# Altium schematic sheet VALVEBOARD_ValveDrive2.SchDoc
size A3; SheetNumber: 5; SheetTotal: 7
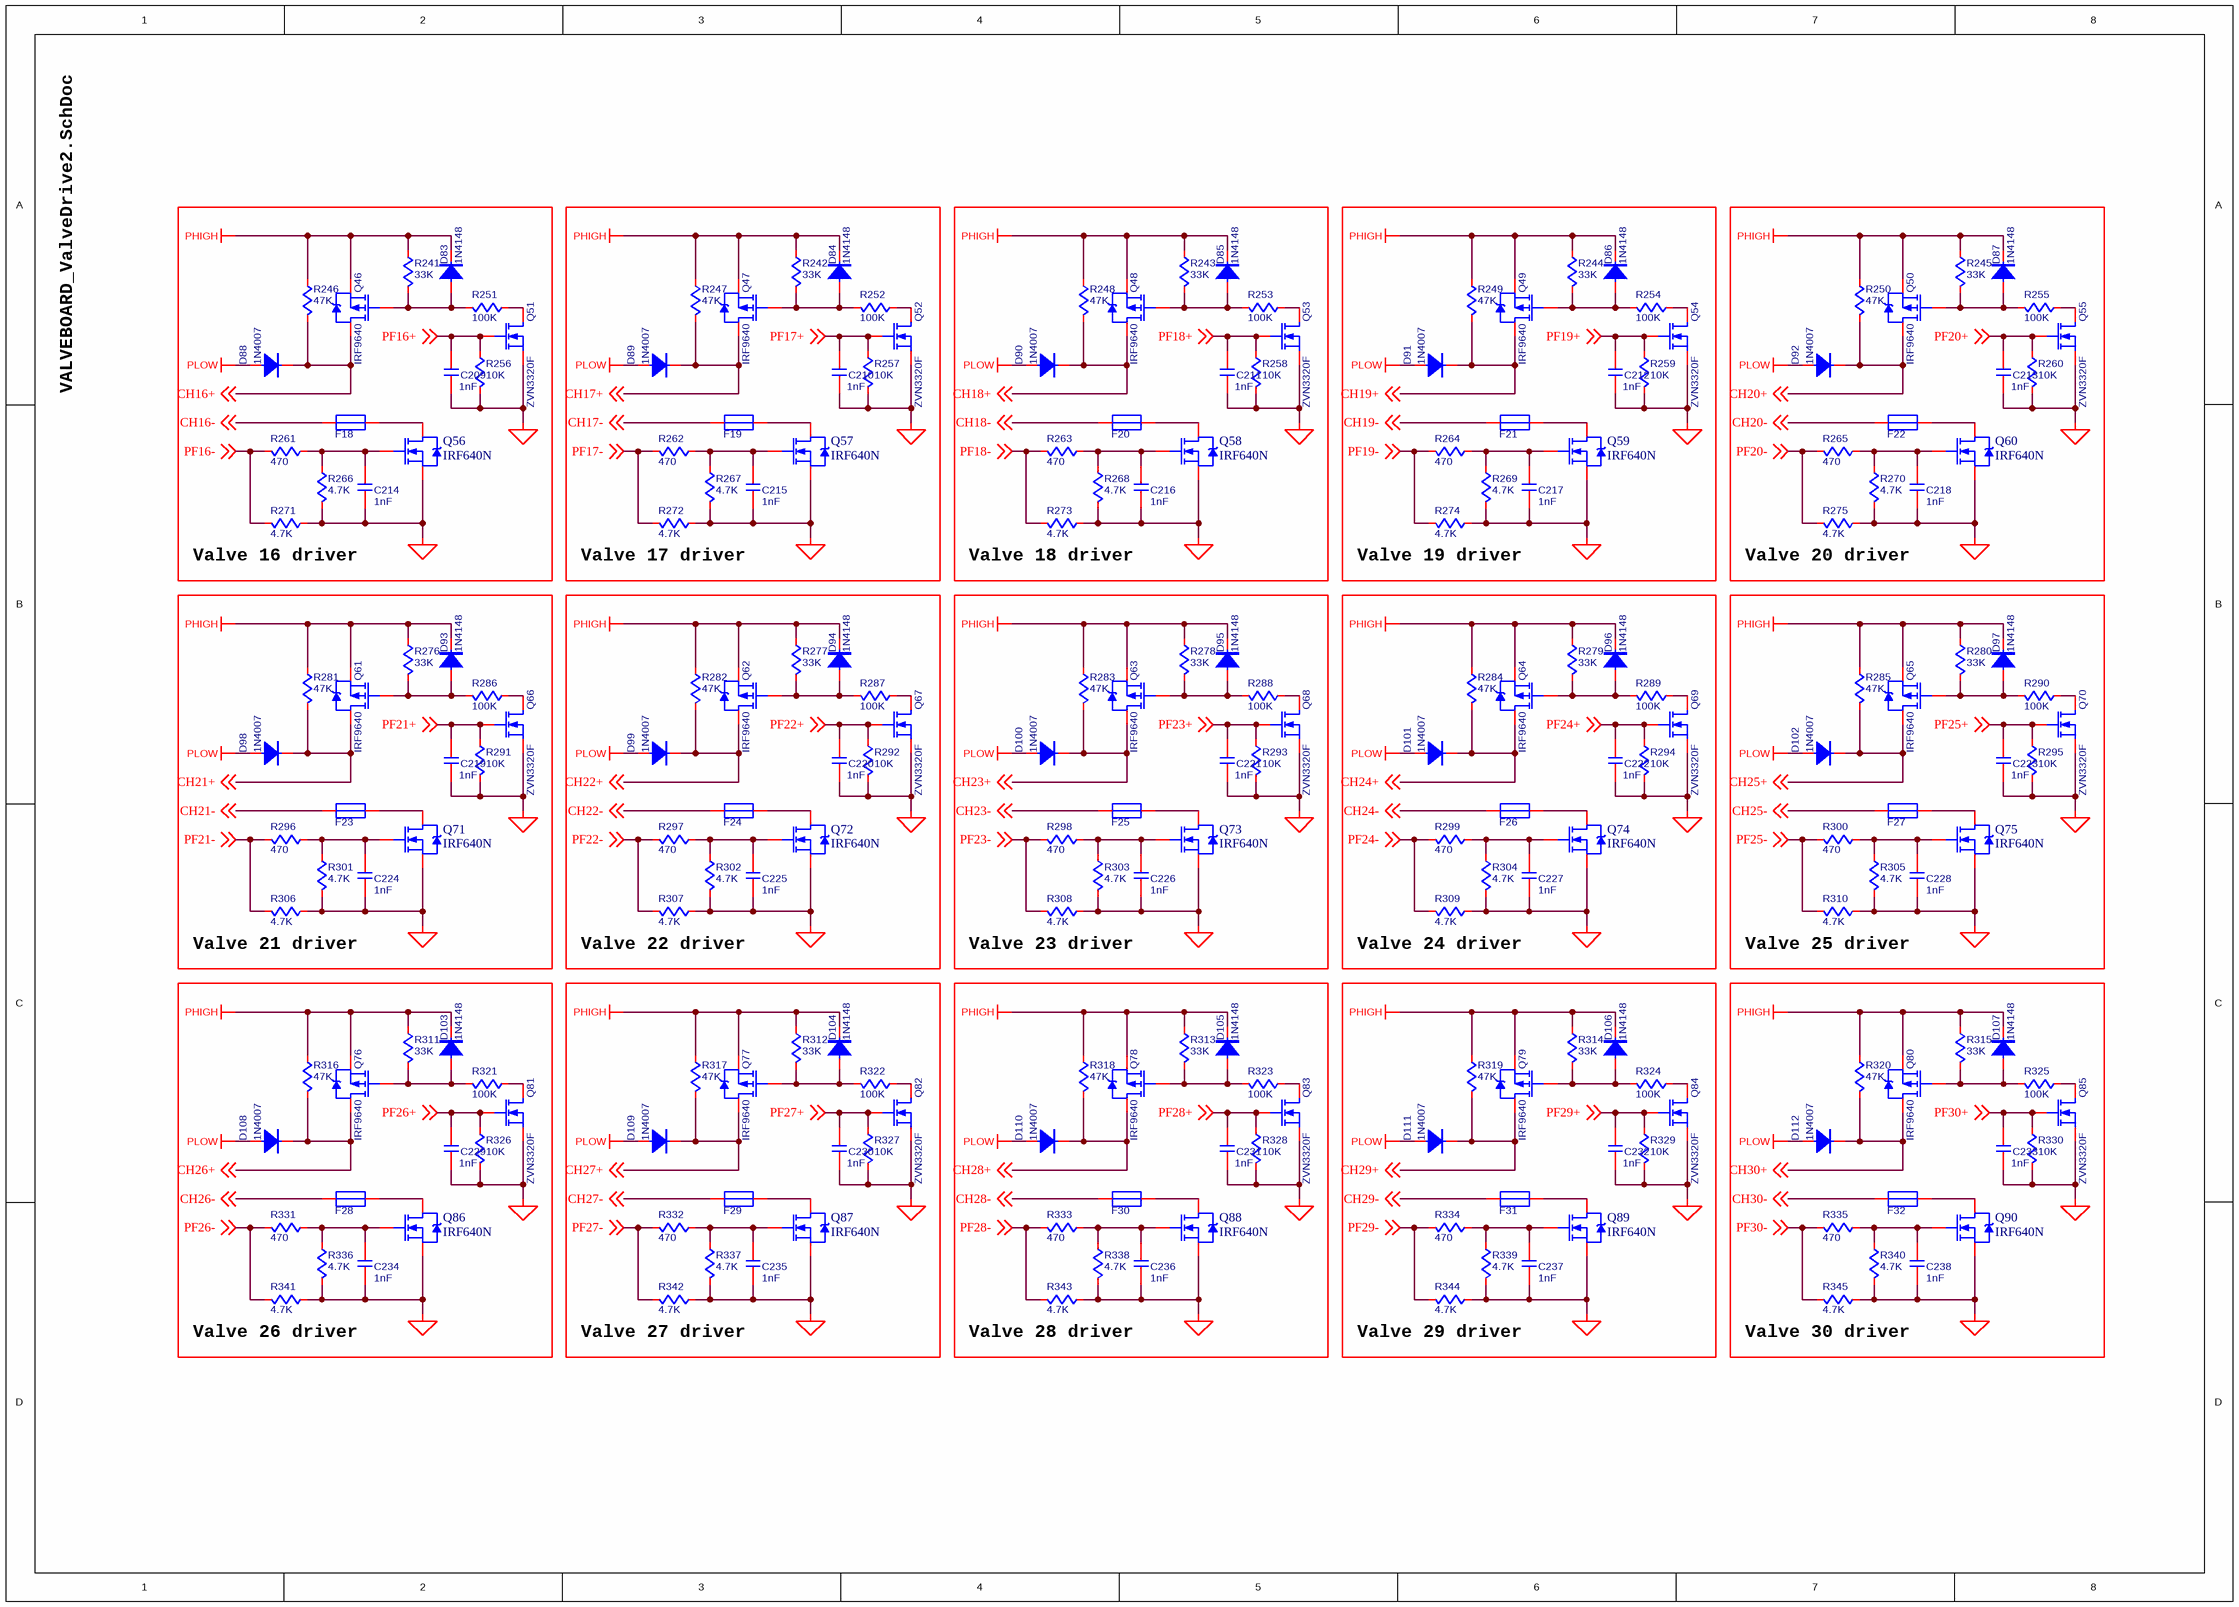
[diagram p0: VALVEBOARD_ValveDrive2.SchDoc]

## Parts
C209  value 1nF  [C0603]  (hidden comment: C-NOMO)
C210  value 1nF  [C0603]  (hidden comment: C-NOMO)
C211  value 1nF  [C0603]  (hidden comment: C-NOMO)
C212  value 1nF  [C0603]  (hidden comment: C-NOMO)
C213  value 1nF  [C0603]  (hidden comment: C-NOMO)
C214  value 1nF  [C0603]  (hidden comment: C-NOMO)
C215  value 1nF  [C0603]  (hidden comment: C-NOMO)
C216  value 1nF  [C0603]  (hidden comment: C-NOMO)
C217  value 1nF  [C0603]  (hidden comment: C-NOMO)
C218  value 1nF  [C0603]  (hidden comment: C-NOMO)
C219  value 1nF  [C0603]  (hidden comment: C-NOMO)
C220  value 1nF  [C0603]  (hidden comment: C-NOMO)
C221  value 1nF  [C0603]  (hidden comment: C-NOMO)
C222  value 1nF  [C0603]  (hidden comment: C-NOMO)
C223  value 1nF  [C0603]  (hidden comment: C-NOMO)
C224  value 1nF  [C0603]  (hidden comment: C-NOMO)
C225  value 1nF  [C0603]  (hidden comment: C-NOMO)
C226  value 1nF  [C0603]  (hidden comment: C-NOMO)
C227  value 1nF  [C0603]  (hidden comment: C-NOMO)
C228  value 1nF  [C0603]  (hidden comment: C-NOMO)
C229  value 1nF  [C0603]  (hidden comment: C-NOMO)
C230  value 1nF  [C0603]  (hidden comment: C-NOMO)
C231  value 1nF  [C0603]  (hidden comment: C-NOMO)
C232  value 1nF  [C0603]  (hidden comment: C-NOMO)
C233  value 1nF  [C0603]  (hidden comment: C-NOMO)
C234  value 1nF  [C0603]  (hidden comment: C-NOMO)
C235  value 1nF  [C0603]  (hidden comment: C-NOMO)
C236  value 1nF  [C0603]  (hidden comment: C-NOMO)
C237  value 1nF  [C0603]  (hidden comment: C-NOMO)
C238  value 1nF  [C0603]  (hidden comment: C-NOMO)
D83  1N4148  [sod-123]
D84  1N4148  [sod-123]
D85  1N4148  [sod-123]
D86  1N4148  [sod-123]
D87  1N4148  [sod-123]
D88  1N4007  [1N4148]
D89  1N4007  [1N4148]
D90  1N4007  [1N4148]
D91  1N4007  [1N4148]
D92  1N4007  [1N4148]
D93  1N4148  [sod-123]
D94  1N4148  [sod-123]
D95  1N4148  [sod-123]
D96  1N4148  [sod-123]
D97  1N4148  [sod-123]
D98  1N4007  [1N4148]
D99  1N4007  [1N4148]
D100  1N4007  [1N4148]
D101  1N4007  [1N4148]
D102  1N4007  [1N4148]
D103  1N4148  [sod-123]
D104  1N4148  [sod-123]
D105  1N4148  [sod-123]
D106  1N4148  [sod-123]
D107  1N4148  [SOD-123]
D108  1N4007  [1N4148]
D109  1N4007  [1N4148]
D110  1N4007  [1N4148]
D111  1N4007  [1N4148]
D112  1N4007  [1N4148]
F18  F50  [F-TH]  (value not drawn)
F19  F50  [F-TH]  (value not drawn)
F20  F50  [F-TH]  (value not drawn)
F21  F50  [F-TH]  (value not drawn)
F22  F50  [F-TH]  (value not drawn)
F23  F50  [F-TH]  (value not drawn)
F24  F50  [F-TH]  (value not drawn)
F25  F50  [F-TH]  (value not drawn)
F26  F50  [F-TH]  (value not drawn)
F27  F50  [F-TH]  (value not drawn)
F28  F50  [F-TH]  (value not drawn)
F29  F50  [F-TH]  (value not drawn)
F30  F50  [F-TH]  (value not drawn)
F31  F50  [F-TH]  (value not drawn)
F32  F50  [F-TH]  (value not drawn)
Q46  IRF9640  [TO-220AB]
Q47  IRF9640  [TO-220AB]
Q48  IRF9640  [TO-220AB]
Q49  IRF9640  [TO-220AB]
Q50  IRF9640  [TO-220AB]
Q51  ZVN3320F  [ZVN3320F]
Q52  ZVN3320F  [ZVN3320F]
Q53  ZVN3320F  [ZVN3320F]
Q54  ZVN3320F  [ZVN3320F]
Q55  ZVN3320F  [ZVN3320F]
Q56  IRF640N  [TO-220AB]
Q57  IRF640N  [TO-220AB]
Q58  IRF640N  [TO-220AB]
Q59  IRF640N  [TO-220AB]
Q60  IRF640N  [TO-220AB]
Q61  IRF9640  [TO-220AB]
Q62  IRF9640  [TO-220AB]
Q63  IRF9640  [TO-220AB]
Q64  IRF9640  [TO-220AB]
Q65  IRF9640  [TO-220AB]
Q66  ZVN3320F  [ZVN3320F]
Q67  ZVN3320F  [ZVN3320F]
Q68  ZVN3320F  [ZVN3320F]
Q69  ZVN3320F  [ZVN3320F]
Q70  ZVN3320F  [ZVN3320F]
Q71  IRF640N  [TO-220AB]
Q72  IRF640N  [TO-220AB]
Q73  IRF640N  [TO-220AB]
Q74  IRF640N  [TO-220AB]
Q75  IRF640N  [TO-220AB]
Q76  IRF9640  [TO-220AB]
Q77  IRF9640  [TO-220AB]
Q78  IRF9640  [TO-220AB]
Q79  IRF9640  [TO-220AB]
Q80  IRF9640  [TO-220AB]
Q81  ZVN3320F  [ZVN3320F]
Q82  ZVN3320F  [ZVN3320F]
Q83  ZVN3320F  [ZVN3320F]
Q84  ZVN3320F  [ZVN3320F]
Q85  ZVN3320F  [ZVN3320F]
Q86  IRF640N  [TO-220AB]
Q87  IRF640N  [TO-220AB]
Q88  IRF640N  [TO-220AB]
Q89  IRF640N  [TO-220AB]
Q90  IRF640N  [TO-220AB]
R241  value 33K  [R0603]  (hidden comment: R)
R242  value 33K  [R0603]  (hidden comment: R)
R243  value 33K  [R0603]  (hidden comment: R)
R244  value 33K  [R0603]  (hidden comment: R)
R245  value 33K  [R0603]  (hidden comment: R)
R246  value 47K  [R2512]  (hidden comment: R)
R247  value 47K  [R2512]  (hidden comment: R)
R248  value 47K  [R2512]  (hidden comment: R)
R249  value 47K  [R2512]  (hidden comment: R)
R250  value 47K  [R2512]  (hidden comment: R)
R251  value 100K  [R0603]  (hidden comment: R)
R252  value 100K  [R0603]  (hidden comment: R)
R253  value 100K  [R0603]  (hidden comment: R)
R254  value 100K  [R0603]  (hidden comment: R)
R255  value 100K  [R0603]  (hidden comment: R)
R256  value 10K  [R0603]  (hidden comment: R)
R257  value 10K  [R0603]  (hidden comment: R)
R258  value 10K  [R0603]  (hidden comment: R)
R259  value 10K  [R0603]  (hidden comment: R)
R260  value 10K  [R0603]  (hidden comment: R)
R261  value 470  [R0402]  (hidden comment: R)
R262  value 470  [R0402]  (hidden comment: R)
R263  value 470  [R0402]  (hidden comment: R)
R264  value 470  [R0402]  (hidden comment: R)
R265  value 470  [R0402]  (hidden comment: R)
R266  value 4.7K  [R0402]  (hidden comment: R)
R267  value 4.7K  [R0402]  (hidden comment: R)
R268  value 4.7K  [R0402]  (hidden comment: R)
R269  value 4.7K  [R0402]  (hidden comment: R)
R270  value 4.7K  [R0402]  (hidden comment: R)
R271  value 4.7K  [R0402]  (hidden comment: R)
R272  value 4.7K  [R0402]  (hidden comment: R)
R273  value 4.7K  [R0402]  (hidden comment: R)
R274  value 4.7K  [R0402]  (hidden comment: R)
R275  value 4.7K  [R0402]  (hidden comment: R)
R276  value 33K  [R0603]  (hidden comment: R)
R277  value 33K  [R0603]  (hidden comment: R)
R278  value 33K  [R0603]  (hidden comment: R)
R279  value 33K  [R0603]  (hidden comment: R)
R280  value 33K  [R0603]  (hidden comment: R)
R281  value 47K  [R2512]  (hidden comment: R)
R282  value 47K  [R2512]  (hidden comment: R)
R283  value 47K  [R2512]  (hidden comment: R)
R284  value 47K  [R2512]  (hidden comment: R)
R285  value 47K  [R2512]  (hidden comment: R)
R286  value 100K  [R0603]  (hidden comment: R)
R287  value 100K  [R0603]  (hidden comment: R)
R288  value 100K  [R0603]  (hidden comment: R)
R289  value 100K  [R0603]  (hidden comment: R)
R290  value 100K  [R0603]  (hidden comment: R)
R291  value 10K  [R0603]  (hidden comment: R)
R292  value 10K  [R0603]  (hidden comment: R)
R293  value 10K  [R0603]  (hidden comment: R)
R294  value 10K  [R0603]  (hidden comment: R)
R295  value 10K  [R0603]  (hidden comment: R)
R296  value 470  [R0402]  (hidden comment: R)
R297  value 470  [R0402]  (hidden comment: R)
R298  value 470  [R0402]  (hidden comment: R)
R299  value 470  [R0402]  (hidden comment: R)
R300  value 470  [R0402]  (hidden comment: R)
R301  value 4.7K  [R0402]  (hidden comment: R)
R302  value 4.7K  [R0402]  (hidden comment: R)
R303  value 4.7K  [R0402]  (hidden comment: R)
R304  value 4.7K  [R0402]  (hidden comment: R)
R305  value 4.7K  [R0402]  (hidden comment: R)
R306  value 4.7K  [R0402]  (hidden comment: R)
R307  value 4.7K  [R0402]  (hidden comment: R)
R308  value 4.7K  [R0402]  (hidden comment: R)
R309  value 4.7K  [R0402]  (hidden comment: R)
R310  value 4.7K  [R0402]  (hidden comment: R)
R311  value 33K  [R0603]  (hidden comment: R)
R312  value 33K  [R0603]  (hidden comment: R)
R313  value 33K  [R0603]  (hidden comment: R)
R314  value 33K  [R0603]  (hidden comment: R)
R315  value 33K  [R0603]  (hidden comment: R)
R316  value 47K  [R2512]  (hidden comment: R)
R317  value 47K  [R2512]  (hidden comment: R)
R318  value 47K  [R2512]  (hidden comment: R)
R319  value 47K  [R2512]  (hidden comment: R)
R320  value 47K  [R2512]  (hidden comment: R)
R321  value 100K  [R0603]  (hidden comment: R)
R322  value 100K  [R0603]  (hidden comment: R)
R323  value 100K  [R0603]  (hidden comment: R)
R324  value 100K  [R0603]  (hidden comment: R)
R325  value 100K  [R0603]  (hidden comment: R)
R326  value 10K  [R0603]  (hidden comment: R)
R327  value 10K  [R0603]  (hidden comment: R)
R328  value 10K  [R0603]  (hidden comment: R)
R329  value 10K  [R0603]  (hidden comment: R)
R330  value 10K  [R0603]  (hidden comment: R)
R331  value 470  [R0402]  (hidden comment: R)
R332  value 470  [R0402]  (hidden comment: R)
R333  value 470  [R0402]  (hidden comment: R)
R334  value 470  [R0402]  (hidden comment: R)
R335  value 470  [R0402]  (hidden comment: R)
R336  value 4.7K  [R0402]  (hidden comment: R)
R337  value 4.7K  [R0402]  (hidden comment: R)
R338  value 4.7K  [R0402]  (hidden comment: R)
R339  value 4.7K  [R0402]  (hidden comment: R)
R340  value 4.7K  [R0402]  (hidden comment: R)
R341  value 4.7K  [R0402]  (hidden comment: R)
R342  value 4.7K  [R0402]  (hidden comment: R)
R343  value 4.7K  [R0402]  (hidden comment: R)
R344  value 4.7K  [R0402]  (hidden comment: R)
R345  value 4.7K  [R0402]  (hidden comment: R)

## Blocks framed on the sheet
Valve 16 driver: C209 C214 D83 D88 F18 Q46 Q51 Q56 R241 R246 R251 R256 R261 R266 R271
Valve 17 driver: C210 C215 D84 D89 F19 Q47 Q52 Q57 R242 R247 R252 R257 R262 R267 R272
Valve 18 driver: C211 C216 D85 D90 F20 Q48 Q53 Q58 R243 R248 R253 R258 R263 R268 R273
Valve 19 driver: C212 C217 D86 D91 F21 Q49 Q54 Q59 R244 R249 R254 R259 R264 R269 R274
Valve 20 driver: C213 C218 D87 D92 F22 Q50 Q55 Q60 R245 R250 R255 R260 R265 R270 R275
Valve 21 driver: C219 C224 D93 D98 F23 Q61 Q66 Q71 R276 R281 R286 R291 R296 R301 R306
Valve 22 driver: C220 C225 D94 D99 F24 Q62 Q67 Q72 R277 R282 R287 R292 R297 R302 R307
Valve 23 driver: C221 C226 D95 D100 F25 Q63 Q68 Q73 R278 R283 R288 R293 R298 R303 R308
Valve 24 driver: C222 C227 D96 D101 F26 Q64 Q69 Q74 R279 R284 R289 R294 R299 R304 R309
Valve 25 driver: C223 C228 D97 D102 F27 Q65 Q70 Q75 R280 R285 R290 R295 R300 R305 R310
Valve 26 driver: C229 C234 D103 D108 F28 Q76 Q81 Q86 R311 R316 R321 R326 R331 R336 R341
Valve 27 driver: C230 C235 D104 D109 F29 Q77 Q82 Q87 R312 R317 R322 R327 R332 R337 R342
Valve 28 driver: C231 C236 D105 D110 F30 Q78 Q83 Q88 R313 R318 R323 R328 R333 R338 R343
Valve 29 driver: C232 C237 D106 D111 F31 Q79 Q84 Q89 R314 R319 R324 R329 R334 R339 R344
Valve 30 driver: C233 C238 D107 D112 F32 Q80 Q85 Q90 R315 R320 R325 R330 R335 R340 R345

## Nets
PGND: C209.1 C210.1 C211.1 C212.1 C213.1 C214.1 C215.1 C216.1 C217.1 C218.1 C219.1 C220.1 C221.1 C222.1 C223.1 C224.1 C225.1 C226.1 C227.1 C228.1 C229.1 C230.1 C231.1 C232.1 C233.1 C234.1 C235.1 C236.1 C237.1 C238.1 Q51.3(S) Q52.3(S) Q53.3(S) Q54.3(S) Q55.3(S) Q56.3(S) Q57.3(S) Q58.3(S) Q59.3(S) Q60.3(S) Q66.3(S) Q67.3(S) Q68.3(S) Q69.3(S) Q70.3(S) Q71.3(S) Q72.3(S) Q73.3(S) Q74.3(S) Q75.3(S) Q81.3(S) Q82.3(S) Q83.3(S) Q84.3(S) Q85.3(S) Q86.3(S) Q87.3(S) Q88.3(S) Q89.3(S) Q90.3(S) R256.1 R257.1 R258.1 R259.1 R260.1 R266.1 R267.1 R268.1 R269.1 R270.1 R271.2 R272.2 R273.2 R274.2 R275.2 R291.1 R292.1 R293.1 R294.1 R295.1 R301.1 R302.1 R303.1 R304.1 R305.1 R306.2 R307.2 R308.2 R309.2 R310.2 R326.1 R327.1 R328.1 R329.1 R330.1 R336.1 R337.1 R338.1 R339.1 R340.1 R341.2 R342.2 R343.2 R344.2 R345.2
PHIGH: D83.1 D84.1 D85.1 D86.1 D87.1 D93.1 D94.1 D95.1 D96.1 D97.1 D103.1 D104.1 D105.1 D106.1 D107.1 Q46.3(S) Q47.3(S) Q48.3(S) Q49.3(S) Q50.3(S) Q61.3(S) Q62.3(S) Q63.3(S) Q64.3(S) Q65.3(S) Q76.3(S) Q77.3(S) Q78.3(S) Q79.3(S) Q80.3(S) R241.2 R242.2 R243.2 R244.2 R245.2 R246.2 R247.2 R248.2 R249.2 R250.2 R276.2 R277.2 R278.2 R279.2 R280.2 R281.2 R282.2 R283.2 R284.2 R285.2 R311.2 R312.2 R313.2 R314.2 R315.2 R316.2 R317.2 R318.2 R319.2 R320.2
PLOW: D88.2 D89.2 D90.2 D91.2 D92.2 D98.2 D99.2 D100.2 D101.2 D102.2 D108.2 D109.2 D110.2 D111.2 D112.2
CH16+: D88.1 Q46.2(D) R246.1 ; off-sheet CH16+
CH16-: F18.1 ; off-sheet CH16-
CH17+: D89.1 Q47.2(D) R247.1 ; off-sheet CH17+
CH17-: F19.1 ; off-sheet CH17-
CH18+: D90.1 Q48.2(D) R248.1 ; off-sheet CH18+
CH18-: F20.1 ; off-sheet CH18-
CH19+: D91.1 Q49.2(D) R249.1 ; off-sheet CH19+
CH19-: F21.1 ; off-sheet CH19-
CH20+: D92.1 Q50.2(D) R250.1 ; off-sheet CH20+
CH20-: F22.1 ; off-sheet CH20-
CH21+: D98.1 Q61.2(D) R281.1 ; off-sheet CH21+
CH21-: F23.1 ; off-sheet CH21-
CH22+: D99.1 Q62.2(D) R282.1 ; off-sheet CH22+
CH22-: F24.1 ; off-sheet CH22-
CH23+: D100.1 Q63.2(D) R283.1 ; off-sheet CH23+
CH23-: F25.1 ; off-sheet CH23-
CH24+: D101.1 Q64.2(D) R284.1 ; off-sheet CH24+
CH24-: F26.1 ; off-sheet CH24-
CH25+: D102.1 Q65.2(D) R285.1 ; off-sheet CH25+
CH25-: F27.1 ; off-sheet CH25-
CH26+: D108.1 Q76.2(D) R316.1 ; off-sheet CH26+
CH26-: F28.1 ; off-sheet CH26-
CH27+: D109.1 Q77.2(D) R317.1 ; off-sheet CH27+
CH27-: F29.1 ; off-sheet CH27-
CH28+: D110.1 Q78.2(D) R318.1 ; off-sheet CH28+
CH28-: F30.1 ; off-sheet CH28-
CH29+: D111.1 Q79.2(D) R319.1 ; off-sheet CH29+
CH29-: F31.1 ; off-sheet CH29-
CH30+: D112.1 Q80.2(D) R320.1 ; off-sheet CH30+
CH30-: F32.1 ; off-sheet CH30-
PF16+: C209.2 Q51.2(G) R256.2 ; off-sheet PF16+
PF16-: R261.1 R271.1 ; off-sheet PF16-
PF17+: C210.2 Q52.2(G) R257.2 ; off-sheet PF17+
PF17-: R262.1 R272.1 ; off-sheet PF17-
PF18+: C211.2 Q53.2(G) R258.2 ; off-sheet PF18+
PF18-: R263.1 R273.1 ; off-sheet PF18-
PF19+: C212.2 Q54.2(G) R259.2 ; off-sheet PF19+
PF19-: R264.1 R274.1 ; off-sheet PF19-
PF20+: C213.2 Q55.2(G) R260.2 ; off-sheet PF20+
PF20-: R265.1 R275.1 ; off-sheet PF20-
PF21+: C219.2 Q66.2(G) R291.2 ; off-sheet PF21+
PF21-: R296.1 R306.1 ; off-sheet PF21-
PF22+: C220.2 Q67.2(G) R292.2 ; off-sheet PF22+
PF22-: R297.1 R307.1 ; off-sheet PF22-
PF23+: C221.2 Q68.2(G) R293.2 ; off-sheet PF23+
PF23-: R298.1 R308.1 ; off-sheet PF23-
PF24+: C222.2 Q69.2(G) R294.2 ; off-sheet PF24+
PF24-: R299.1 R309.1 ; off-sheet PF24-
PF25+: C223.2 Q70.2(G) R295.2 ; off-sheet PF25+
PF25-: R300.1 R310.1 ; off-sheet PF25-
PF26+: C229.2 Q81.2(G) R326.2 ; off-sheet PF26+
PF26-: R331.1 R341.1 ; off-sheet PF26-
PF27+: C230.2 Q82.2(G) R327.2 ; off-sheet PF27+
PF27-: R332.1 R342.1 ; off-sheet PF27-
PF28+: C231.2 Q83.2(G) R328.2 ; off-sheet PF28+
PF28-: R333.1 R343.1 ; off-sheet PF28-
PF29+: C232.2 Q84.2(G) R329.2 ; off-sheet PF29+
PF29-: R334.1 R344.1 ; off-sheet PF29-
PF30+: C233.2 Q85.2(G) R330.2 ; off-sheet PF30+
PF30-: R335.1 R345.1 ; off-sheet PF30-
NetC214_2: C214.2 Q56.1(G) R261.2 R266.2
NetC215_2: C215.2 Q57.1(G) R262.2 R267.2
NetC216_2: C216.2 Q58.1(G) R263.2 R268.2
NetC217_2: C217.2 Q59.1(G) R264.2 R269.2
NetC218_2: C218.2 Q60.1(G) R265.2 R270.2
NetC224_2: C224.2 Q71.1(G) R296.2 R301.2
NetC225_2: C225.2 Q72.1(G) R297.2 R302.2
NetC226_2: C226.2 Q73.1(G) R298.2 R303.2
NetC227_2: C227.2 Q74.1(G) R299.2 R304.2
NetC228_2: C228.2 Q75.1(G) R300.2 R305.2
NetC234_2: C234.2 Q86.1(G) R331.2 R336.2
NetC235_2: C235.2 Q87.1(G) R332.2 R337.2
NetC236_2: C236.2 Q88.1(G) R333.2 R338.2
NetC237_2: C237.2 Q89.1(G) R334.2 R339.2
NetC238_2: C238.2 Q90.1(G) R335.2 R340.2
NetD83_2: D83.2 Q46.1(G) R241.1 R251.1
NetD84_2: D84.2 Q47.1(G) R242.1 R252.1
NetD85_2: D85.2 Q48.1(G) R243.1 R253.1
NetD86_2: D86.2 Q49.1(G) R244.1 R254.1
NetD87_2: D87.2 Q50.1(G) R245.1 R255.1
NetD93_2: D93.2 Q61.1(G) R276.1 R286.1
NetD94_2: D94.2 Q62.1(G) R277.1 R287.1
NetD95_2: D95.2 Q63.1(G) R278.1 R288.1
NetD96_2: D96.2 Q64.1(G) R279.1 R289.1
NetD97_2: D97.2 Q65.1(G) R280.1 R290.1
NetD103_2: D103.2 Q76.1(G) R311.1 R321.1
NetD104_2: D104.2 Q77.1(G) R312.1 R322.1
NetD105_2: D105.2 Q78.1(G) R313.1 R323.1
NetD106_2: D106.2 Q79.1(G) R314.1 R324.1
NetD107_2: D107.2 Q80.1(G) R315.1 R325.1
NetF18_2: F18.2 Q56.2(D)
NetF19_2: F19.2 Q57.2(D)
NetF20_2: F20.2 Q58.2(D)
NetF21_2: F21.2 Q59.2(D)
NetF22_2: F22.2 Q60.2(D)
NetF23_2: F23.2 Q71.2(D)
NetF24_2: F24.2 Q72.2(D)
NetF25_2: F25.2 Q73.2(D)
NetF26_2: F26.2 Q74.2(D)
NetF27_2: F27.2 Q75.2(D)
NetF28_2: F28.2 Q86.2(D)
NetF29_2: F29.2 Q87.2(D)
NetF30_2: F30.2 Q88.2(D)
NetF31_2: F31.2 Q89.2(D)
NetF32_2: F32.2 Q90.2(D)
NetQ51_1: Q51.1(D) R251.2
NetQ52_1: Q52.1(D) R252.2
NetQ53_1: Q53.1(D) R253.2
NetQ54_1: Q54.1(D) R254.2
NetQ55_1: Q55.1(D) R255.2
NetQ66_1: Q66.1(D) R286.2
NetQ67_1: Q67.1(D) R287.2
NetQ68_1: Q68.1(D) R288.2
NetQ69_1: Q69.1(D) R289.2
NetQ70_1: Q70.1(D) R290.2
NetQ81_1: Q81.1(D) R321.2
NetQ82_1: Q82.1(D) R322.2
NetQ83_1: Q83.1(D) R323.2
NetQ84_1: Q84.1(D) R324.2
NetQ85_1: Q85.1(D) R325.2

## Library data of the parts
C209-C238 = C-NOMO: voltage: 25V; precision: 5%
D83-D112 = DIOD1
Q46-Q50 Q61-Q65 Q76-Q80 = IRF9640: P-Channel Power MOSFET; Note: Pin 4 not drawn and electrically connected to Pin 2.; Published: 8-Jun-2000; LatestRevisionDate: 17-Jul-2002; LatestRevisionNote: Re-released for DXP Platform.; DatasheetVersion: PD-9.390D; PackageVersion: Feb-1997; PackageReference: TO-220AB; Publisher: Altium Limited; PackageDescription: TO, Thru-Hole, Vertical, Heatsink Mounted; 3 In-Line Leads; Pitch 2.54 mm; ComponentLink1Description: Manufacturer Link; ComponentLink1URL: http://www.irf.com/
Q51-Q55 Q66-Q70 Q81-Q85 = ZVN3320F: N-Channel MOSFET; Published: 8-Jun-2000; LatestRevisionDate: 17-Jul-2002; LatestRevisionNote: Re-released for DXP Platform.; PackageVersion: 1995/1996; PackageReference: E3; Publisher: Altium Limited; PackageDescription: TO, Flat Index; 3 In-Line, Axial Leads; Body Dia. 4.6mm; Lead Dia. 0.5 mm (max)
Q56-Q60 Q71-Q75 Q86-Q90 = IRF640N: N-Channel Power MOSFET; Note: Pin 2 is electrically connected to pin 4.; Published: 8-Jun-2000; LatestRevisionDate: 17-Jul-2002; LatestRevisionNote: Re-released for DXP Platform.; DatasheetVersion: PD-9.814; PackageVersion: Feb-1997; PackageReference: TO-220AB; Publisher: Altium Limited; PackageDescription: TO, Thru-Hole, Vertical, Heatsink Mounted; 3 In-Line Leads; Pitch 2.54 mm; ComponentLink1Description: Manufacturer Link; ComponentLink1URL: http://www.irf.com/
R241-R345 = R: precision: 1%